# Altium schematic sheet Revision_Note.SchDoc
size A4; Date: 22.07.2025; CheckedBy: Own Checked; Author: A4; CompanyName: No Company; DocumentNumber: ELK.PCB.0001.0001.A.A; Revision: V0.0.1; SheetNumber: 2; SheetTotal: 5
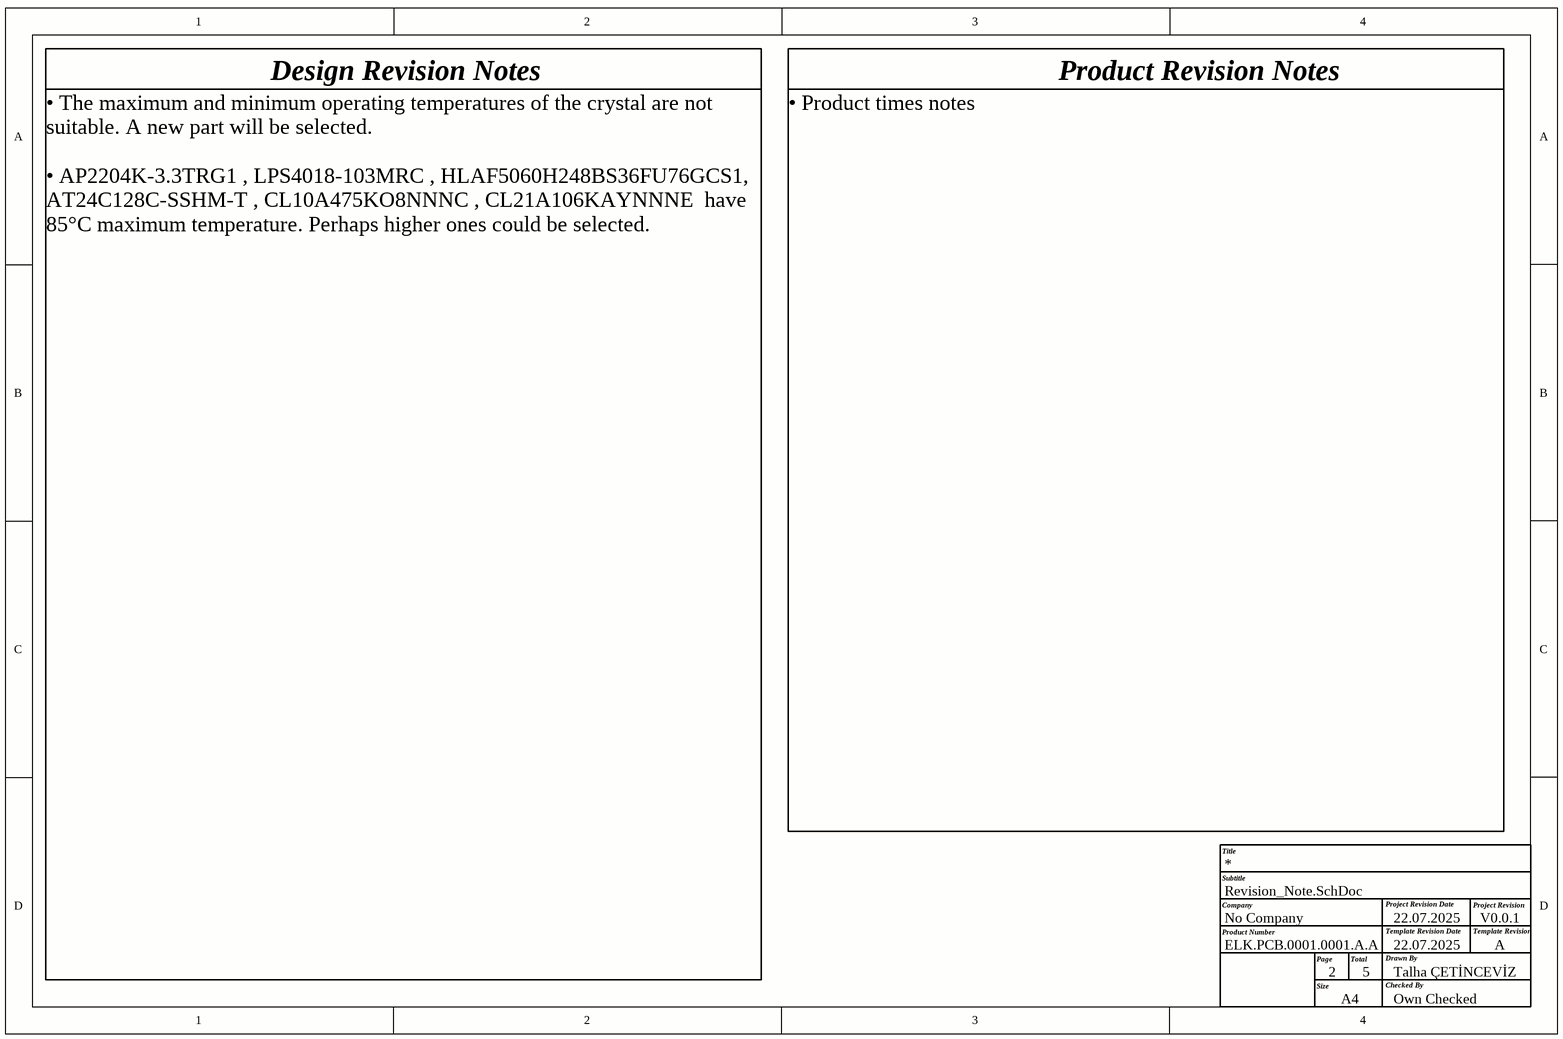
[diagram p0: Revision_Note.SchDoc]

## Notes on the sheet
- Design Revision Notes
- Product Revision Notes
- • Product times notes
- • The maximum and minimum operating temperatures of the crystal are not suitable. A new part will be selected.
  • AP2204K-3.3TRG1 , LPS4018-103MRC , HLAF5060H248BS36FU76GCS1, AT24C128C-SSHM-T , CL10A475KO8NNNC , CL21A106KAYNNNE  have 85°C maximum temperature. Perhaps higher ones could be selected.
- Title
- Company
- Product Number
- Subtitle
- Project Revision Date
- Template Revision Date
- Project Revision
- Template Revision
- Size
- Page
- A4
- Total
- Checked By
- Drawn By
- 22.07.2025
- Talha ÇETİNCEVİZ
- A